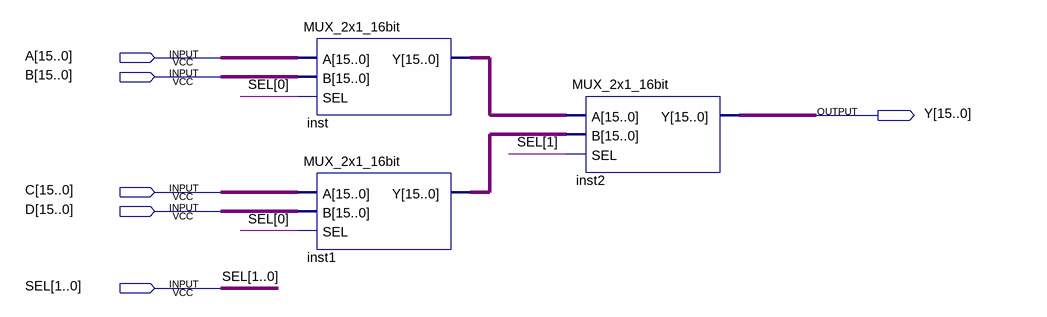
[diagram p0: schematic sheet]
// Quartus schematic MUX_4x1_16bit.bdf as structural Verilog: 3 symbols, 6 pins
module MUX_4x1_16bit (
  input  [15:0] A,
  input  [15:0] B,
  input  [15:0] C,
  input  [15:0] D,
  input  [1:0] SEL,
  output [15:0] Y
);

  wire [15:0] inst1_y, inst_y;

  MUX_2x1_16bit inst (.A(A), .B(B), .SEL(SEL[0]), .Y(inst_y));
  MUX_2x1_16bit inst1 (.A(C), .B(D), .SEL(SEL[0]), .Y(inst1_y));
  MUX_2x1_16bit inst2 (.A(inst_y), .B(inst1_y), .SEL(SEL[1]), .Y(Y));
endmodule
